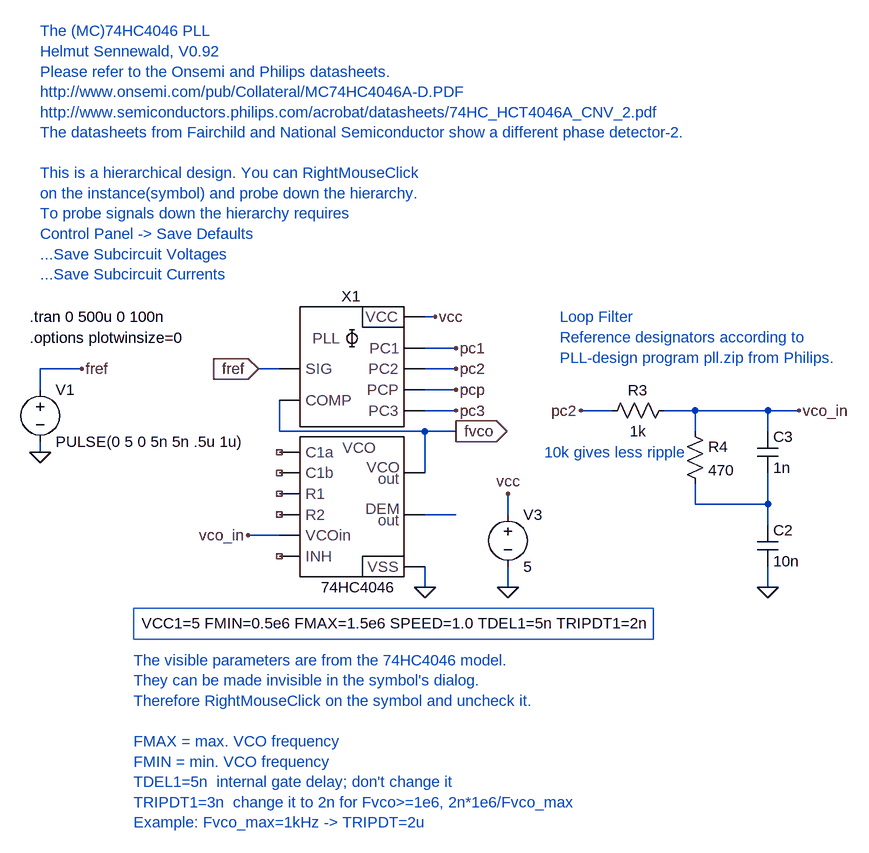
[diagram p0: schematic MC74HC4046A_h_test.asc]
MC74HC4046A_h_test.asc, the LTspice schematic file:
Version 4
SHEET 1 2020 1976
WIRE -1504 368 -1520 368
WIRE -1472 416 -1520 416
WIRE -2048 448 -2112 448
WIRE -1744 448 -1776 448
WIRE -1472 448 -1520 448
WIRE -2112 480 -2112 448
WIRE -1472 480 -1520 480
WIRE -1472 512 -1520 512
WIRE -1232 512 -1280 512
WIRE -1104 512 -1152 512
WIRE -992 512 -1104 512
WIRE -944 512 -992 512
WIRE -1744 544 -1744 496
WIRE -1520 544 -1744 544
WIRE -1472 544 -1520 544
WIRE -1104 544 -1104 512
WIRE -992 544 -992 512
WIRE -2112 576 -2112 560
WIRE -1520 608 -1520 544
WIRE -1104 656 -1104 624
WIRE -992 656 -992 608
WIRE -992 656 -1104 656
WIRE -1472 672 -1520 672
WIRE -1392 672 -1392 640
WIRE -992 688 -992 656
WIRE -1744 704 -1792 704
WIRE -1520 784 -1520 752
WIRE -1392 784 -1392 752
WIRE -992 784 -992 752
FLAG -2112 576 0
FLAG -2048 448 fref
FLAG -1392 784 0
FLAG -1392 640 vcc
FLAG -992 784 0
FLAG -1280 512 pc2
FLAG -944 512 vco_in
FLAG -1792 704 vco_in
FLAG -1472 416 pc1
FLAG -1472 448 pc2
FLAG -1472 480 pcp
FLAG -1472 512 pc3
FLAG -1776 448 fref
IOPIN -1776 448 In
FLAG -1520 784 0
FLAG -1504 368 vcc
FLAG -1472 544 fvco
IOPIN -1472 544 Out
SYMBOL voltage -2112 464 R0
WINDOW 123 0 0 Left 0
WINDOW 39 0 0 Left 0
SYMATTR InstName V1
SYMATTR Value PULSE(0 5 0 5n 5n .5u 1u)
SYMBOL voltage -1392 656 R0
SYMATTR InstName V3
SYMATTR Value 5
SYMBOL res -1248 528 R270
WINDOW 0 32 56 VTop 0
WINDOW 3 0 56 VBottom 0
SYMATTR InstName R3
SYMATTR Value 1k
SYMBOL cap -1008 688 R0
SYMATTR InstName C2
SYMATTR Value 10n
SYMBOL res -1120 528 R0
SYMATTR InstName R4
SYMATTR Value 470
SYMBOL cap -1008 544 R0
SYMATTR InstName C3
SYMATTR Value 1n
SYMBOL 74hc4046a_h -1632 320 R0
WINDOW 39 -324 519 Left 0
SYMATTR SpiceLine VCC1=5 FMIN=0.5e6 FMAX=1.5e6 SPEED=1.0 TDEL1=5n TRIPDT1=2n
SYMATTR InstName X1
TEXT -2128 368 Left 0 !.tran 0 500u 0 100n
TEXT -2128 400 Left 0 !.options plotwinsize=0
TEXT -1968 896 Left 0 ;The visible parameters are from the 74HC4046 model. \nThey can be made invisible in the symbol's dialog.\nTherefore RightMouseClick on the symbol and uncheck it.\n \nFMAX = max. VCO frequency\nFMIN = min. VCO frequency\nTDEL1=5n  internal gate delay; don't change it\nTRIPDT1=3n  change it to 2n for Fvco>=1e6, 2n*1e6/Fvco_max\nExample: Fvco_max=1kHz -> TRIPDT=2u
TEXT -2112 -72 Left 0 ;The (MC)74HC4046 PLL\nHelmut Sennewald, V0.92\nPlease refer to the Onsemi and Philips datasheets.\nhttp://www.onsemi.com/pub/Collateral/MC74HC4046A-D.PDF\nhttp://www.semiconductors.philips.com/acrobat/datasheets/74HC_HCT4046A_CNV_2.pdf\nThe datasheets from Fairchild and National Semiconductor show a different phase detector-2. \n \nThis is a hierarchical design. You can RightMouseClick \non the instance(symbol) and probe down the hierarchy. \nTo probe signals down the hierarchy requires\nControl Panel -> Save Defaults \n...Save Subcircuit Voltages\n...Save Subcircuit Currents
TEXT -1312 368 Left 0 ;Loop Filter\nReference designators according to \nPLL-design program pll.zip from Philips.
TEXT -1336 576 Left 0 ;10k gives less ripple
RECTANGLE Normal -1168 864 -1968 816

The netlist it stands for:
* MC74HC4046A_h_test.asc
V1 fref 0 PULSE(0 5 0 5n 5n .5u 1u)
V3 vcc 0 5
R3 pc2 vco_in 1k
C2 N001 0 10n
R4 vco_in N001 470
C3 vco_in N001 1n
XX1 fvco fref pc1 pc2 pcp pc3 NC_01 NC_02 NC_03 NC_04 vco_in NC_05 N002 fvco 0 vcc 74hc4046a_h params: 74HC4046 VCC1=5 FMIN=0.5e6 FMAX=1.5e6 SPEED=1.0 TDEL1=5n TRIPDT1=2n  ; pins COMP SIG PC1 PC2 PCP PC3 C1A C1B R1 R2 VCOin INH DEMout VCOout VSS VCC
.tran 0 500u 0 100n
.options plotwinsize=0
* The visible parameters are from the 74HC4046 model.
* They can be made invisible in the symbol's dialog.
* Therefore RightMouseClick on the symbol and uncheck it.
* FMAX = max. VCO frequency
* FMIN = min. VCO frequency
* TDEL1=5n  internal gate delay; don't change it
* TRIPDT1=3n  change it to 2n for Fvco>=1e6, 2n*1e6/Fvco_max
* Example: Fvco_max=1kHz -> TRIPDT=2u
* The (MC)74HC4046 PLL
* Helmut Sennewald, V0.92
* Please refer to the Onsemi and Philips datasheets.
* http://www.onsemi.com/pub/Collateral/MC74HC4046A-D.PDF
* http://www.semiconductors.philips.com/acrobat/datasheets/74HC_HCT4046A_CNV_2.pdf
* The datasheets from Fairchild and National Semiconductor show a different phase detector-2.
* This is a hierarchical design. You can RightMouseClick
* on the instance(symbol) and probe down the hierarchy.
* To probe signals down the hierarchy requires
* Control Panel -> Save Defaults
* ...Save Subcircuit Voltages
* ...Save Subcircuit Currents
* Loop Filter
* Reference designators according to
* PLL-design program pll.zip from Philips.
* 10k gives less ripple
.backanno
.end